# Altium project IBB.PrjPcb (part 5 of 12)
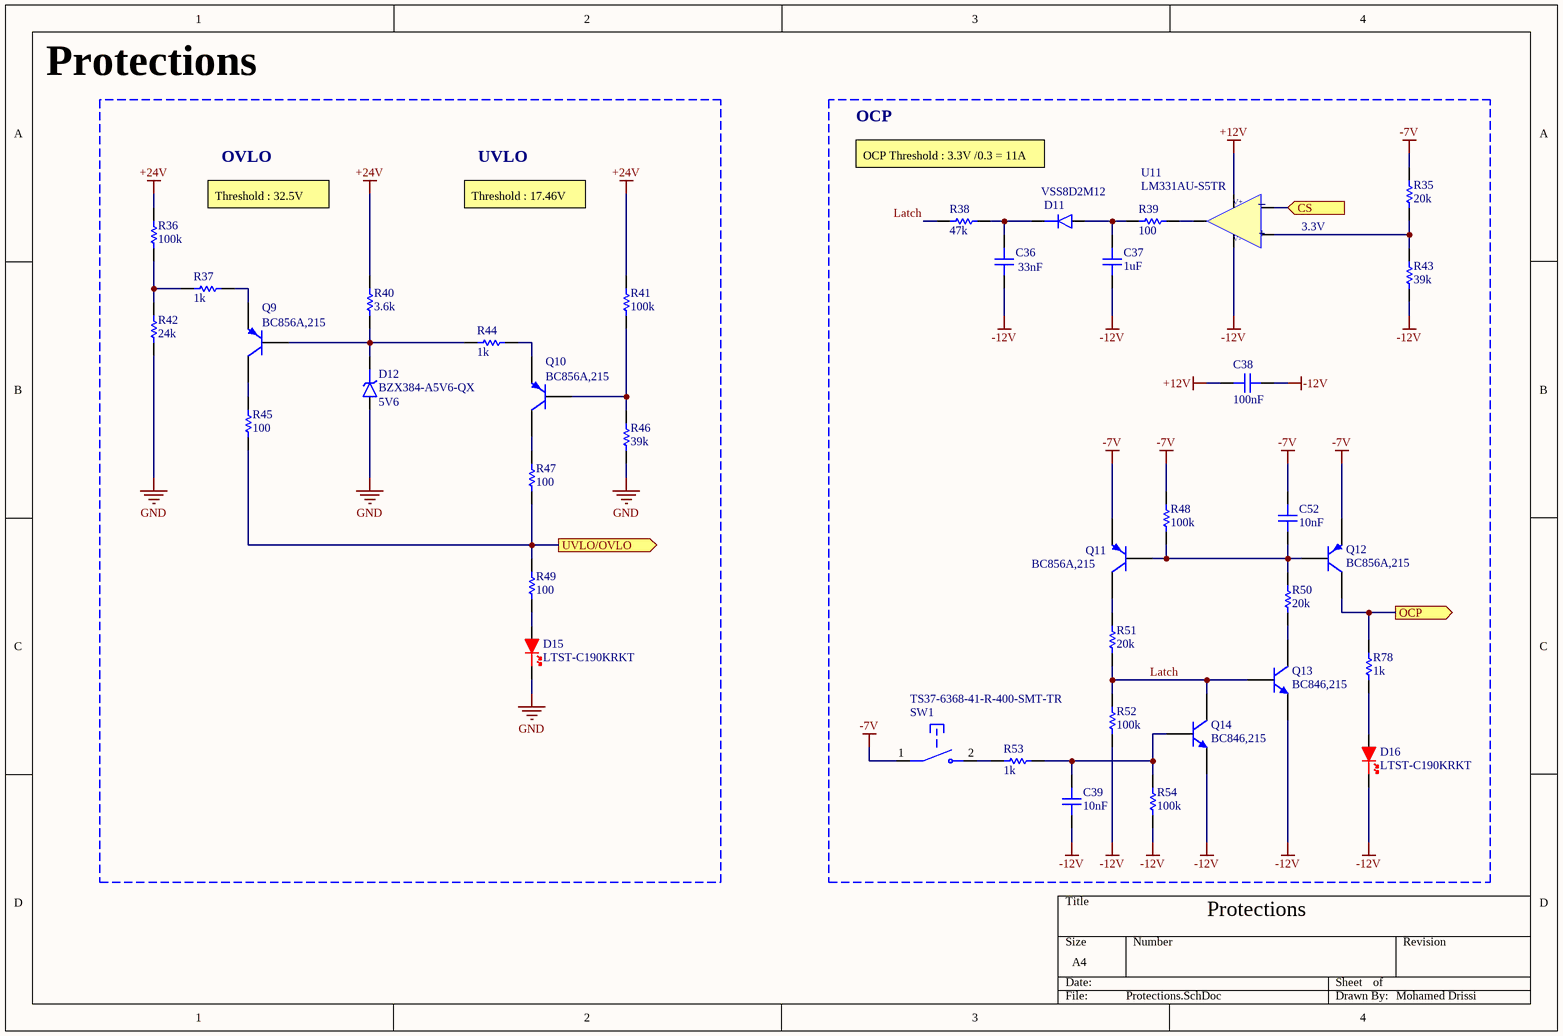
[diagram p10: Protections.SchDoc]

## Sheet Protections.SchDoc (continued)

### Parts
C36  Capacitance: 33nF  [cap_0603]  (hidden comment: CC0603KRX7R0BB333)
C37  Capacitance: 1uF  [cap_1206]  (hidden comment: 885382208005)
C38  Capacitance: 100nF  [cap_0603]  (hidden comment: GMC10X7R104K100NT)
C39  Capacitance: 10nF  [cap_0603]  (hidden comment: C0603C103K4RACTU)
C52  Capacitance: 10nF  [cap_0603]  (hidden comment: C0603C103K4RACTU)
D11  VSS8D2M12  [DO-221AD]
D12  BZX384-A5V6-QX  Zener voltage: 5V6  [SOD-323]
D15  LTST-C190KRKT  [LED]
D16  LTST-C190KRKT  [LED]
Q9  BC856A,215  [sot23]
Q10  BC856A,215  [sot23]
Q11  BC856A,215  [sot23]
Q12  BC856A,215  [sot23]
Q13  BC846,215  [sot23]
Q14  BC846,215  [sot23]
R35  value 20k  [res_0603]  (hidden comment: CPF0603F20KC1)
R36  Resistance: 100k  [res_0603]  (hidden comment: CRCW0603100KFKEA)
R37  Resistance: 1k  [res_0603]  (hidden comment: RC0603FR-071KL)
R38  Resistance: 47k  [res_0603]  (hidden comment: RC0603FR-0747KL)
R39  Resistance: 100  [res_0603]  (hidden comment: RC0603FR-07100RL)
R40  Resistance: 3.6k  [res_0603]  (hidden comment: RC0603FR-073K6L)
R41  Resistance: 100k  [res_0603]  (hidden comment: CRCW0603100KFKEA)
R42  Resistance: 24k  [res_0603]  (hidden comment: RC0603FR-0724KL)
R43  value 39k  [res_0603]  (hidden comment: MCT06030C3902FP500)
R44  Resistance: 1k  [res_0603]  (hidden comment: RC0603FR-071KL)
R45  Resistance: 100  [res_0603]  (hidden comment: RC0603FR-07100RL)
R46  Resistance: 39k  [res_0603]  (hidden comment: RC0603FR-0739KL)
R47  Resistance: 100  [res_0603]  (hidden comment: RC0603FR-07100RL)
R48  Resistance: 100k  [res_0603]  (hidden comment: CRCW0603100KFKEA)
R49  Resistance: 100  [res_0603]  (hidden comment: RC0603FR-07100RL)
R50  value 20k  [res_0603]  (hidden comment: CPF0603F20KC1)
R51  value 20k  [res_0603]  (hidden comment: CPF0603F20KC1)
R52  Resistance: 100k  [res_0603]  (hidden comment: CRCW0603100KFKEA)
R53  Resistance: 1k  [res_0603]  (hidden comment: RC0603FR-071KL)
R54  Resistance: 100k  [res_0603]  (hidden comment: CRCW0603100KFKEA)
R78  Resistance: 1k  [res_0603]  (hidden comment: RC0603FR-071KL)
SW1  TS37-6368-41-R-400-SMT-TR  [TS37-6368-41-R-400-SMT-TR]
U11  LM331AU-S5TR  [5-Lead SOT-23]

### Blocks framed on the sheet
OCP: C36-C39 C52 D11 D16 Q11-Q14 R35 R38 R39 R43 R48 R50-R54 R78 SW1 U11

### Ports
CS (in, see Main[2C], Control circuit[2B], current sense[3B]), OCP (out, see Main[2C], Control circuit[1C]), UVLO/OVLO (out, see Main[2C], Input switch[2B])

### Nets
+12V: C38.2 U11.5(V+)
+24V: R36.2 R40.2 R41.2
-7V: C52.2 Q11.2(E) Q12.2(E) R35.2 R48.2 SW1.1
-12V: C36.1 C37.1 C38.1 C39.1 D16.K Q13.2(E) Q14.2(E) R43.1 R52.1 R54.1 U11.2(V-)
GND: D12.A D15.K R42.1 R46.1
Latch: Q13.1(B) Q14.3(C) R38.1 R51.1 R52.2
NetC36_2: C36.2 D11.C R38.2
NetC37_2: C37.2 D11.A R39.1
NetC39_2: C39.2 Q14.1(B) R53.2 R54.2
NetC52_1: C52.1 Q11.1(B) Q12.1(B) R48.1 R50.2
NetD12_K: D12.K Q9.1(B) R40.1 R44.1
NetD15_A: D15.A R49.1
NetD16_A: D16.A R78.1
NetQ3_2: Q12.3(C) R78.2 ; port OCP
NetQ8_1: R45.1 R47.1 R49.2 ; port UVLO/OVLO
NetQ9_2: Q9.2(E) R37.2
NetQ9_3: Q9.3(C) R45.2
NetQ10_1: Q10.1(B) R41.1 R46.2
NetQ10_2: Q10.2(E) R44.2
NetQ10_3: Q10.3(C) R47.2
NetQ11_3: Q11.3(C) R51.2
NetQ13_3: Q13.3(C) R50.1
NetR35_1: R35.1 R43.2 U11.1(IN-)
NetR36_1: R36.1 R37.1 R42.2
NetR39_2: R39.2 U11.4(OUT)
NetR53_1: R53.1 SW1.2
NetU6_1: U11.3(IN+) ; port CS

### Notes on the sheet
- Protections
- OVLO
- UVLO
- OCP Threshold : 3.3V /0.3 = 11A
- Threshold : 32.5V
- Threshold : 17.46V
- (near U11) 3.3V
- Mohamed Drissi
- (in symbol 3Peak LM331AU-S5TR) _; +